# EAGLE design stirrer (EAGLE 7.2.0)
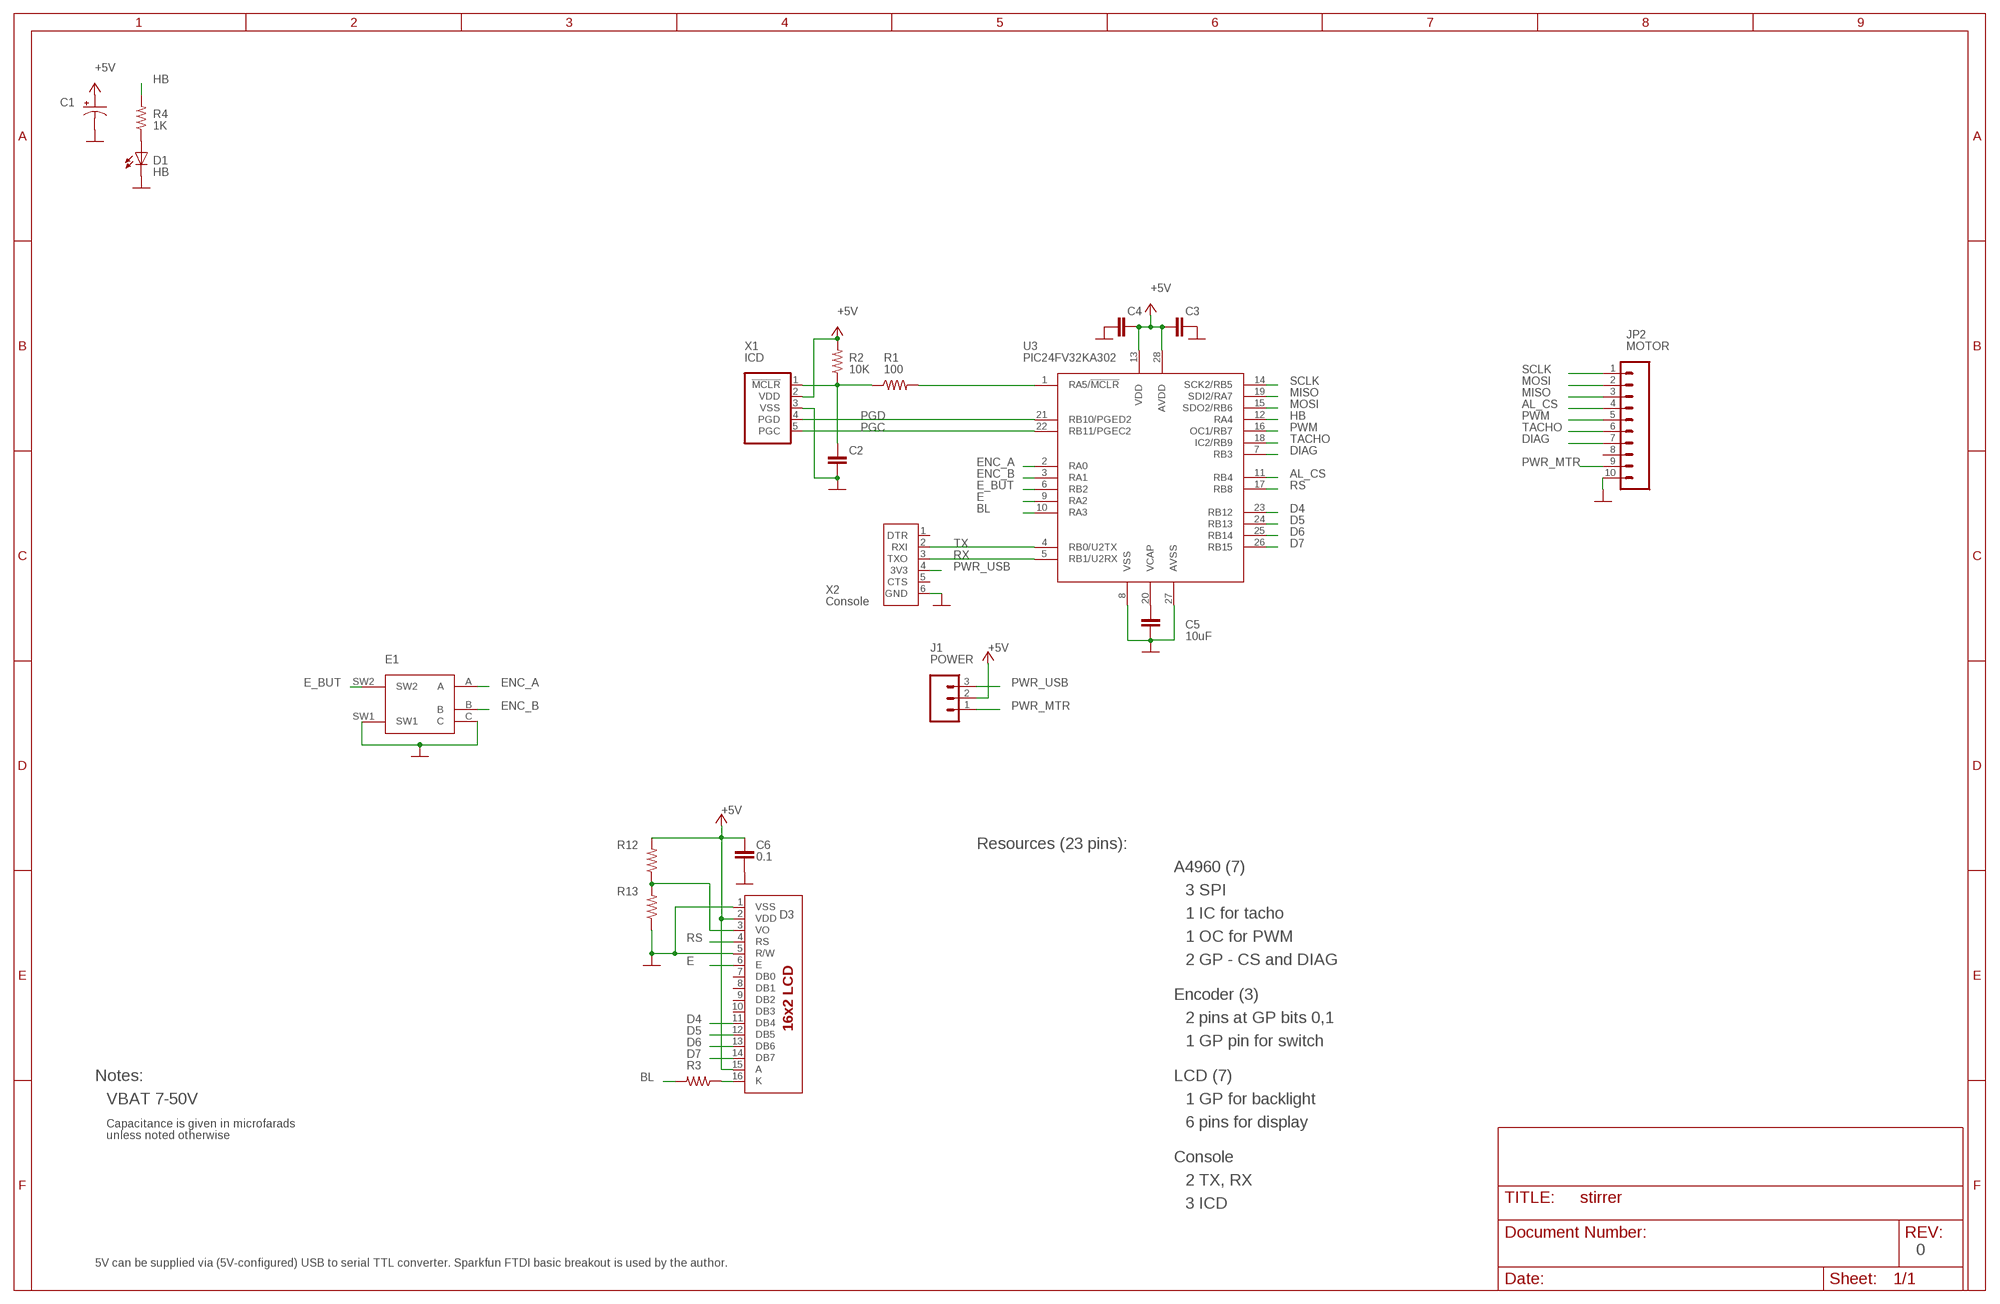
[diagram p0: schematic, sheet 1]

## Parts
C1  CAP_POL-RAD4  [CAP_RAD_4MM]
C2  0.1uF  CAPPTH  [CAP-PTH-SMALL]
C3  0.1uF  CAPPTH  [CAP-PTH-SMALL]
C4  0.1uF  CAPPTH  [CAP-PTH-SMALL]
C5  10uF  CAPPTH  [CAP-PTH-SMALL]
C6  0.1  CAPPTH  [CAP-PTH-SMALL]
D1  HB  LED5MM  [LED5MM]
D3  LCD-16X2-STD  [LCD-16X2]
E1  ROTARY_ENCODER_SWITCH-PEC12_HOR  [ENC_12X14MM_SW_HOR]
J1  POWER  M03PTH  [1X03]
JP2  MOTOR  M100.1  [1X10]
R1  100  RESISTOR-PTH04  [AXIAL-0.4]
R2  10K  RESISTOR-PTH04  [AXIAL-0.4]
R3  RESISTOR-PTH04  [AXIAL-0.4]
R4  1K  RESISTOR-PTH04  [AXIAL-0.4]
R12  RESISTOR-PTH04  [AXIAL-0.4]
R13  RESISTOR-PTH04  [AXIAL-0.4]
U3  PIC24FV32KA302  PIC24FV32KA302_STIR-DIP  [DIL28-3]
X1  ICD  PIC_ICD-STRAIGHT  [1X05]
X2  Console  SERIAL-SF  [1X06]

## Nets
+5V: C1.P(+) C3.1 C4.2 C6.2 D3.2(VDD) D3.15(A) J1.2 R2.P$2 R12.P$2 U3.13(VDD) U3.28(AVDD) X1.2(VDD)
AL_CS: JP2.4 U3.11(RB4)
BL: R3.P$2 U3.10(RA3)
D4: D3.11(DB4) U3.23(RB12)
D5: D3.12(DB5) U3.24(RB13)
D6: D3.13(DB6) U3.25(RB14)
D7: D3.14(DB7) U3.26(RB15)
DIAG: JP2.7 U3.7(RB3)
E: D3.6(E) U3.9(RA2)
E_BUT: E1.SW2 U3.6(RB2)
ENC_A: E1.A U3.2(RA0)
ENC_B: E1.B U3.3(RA1)
GND: C1.N(-) C2.1 C3.2 C4.1 C5.2 C6.1 D1.K(C) D3.1(VSS) D3.5(R/W) E1.C E1.SW1 JP2.10 R13.P$1 U3.8(VSS) U3.27(AVSS) X1.3(VSS) X2.6(GND)
HB: R4.P$2 U3.12(RA4)
MISO: JP2.3 U3.19(SDI2/RA7)
MOSI: JP2.2 U3.15(SDO2/RB6)
N$1: C5.1 U3.20(VCAP)
N$2: R1.P$2 U3.1(RA5/!MCLR)
N$3: D3.16(K) R3.P$1
N$4: D1.A R4.P$1
N$5: D3.3(VO) R12.P$1 R13.P$2
N$12: C2.2 R1.P$1 R2.P$1 X1.1(!MCLR)
PGC: U3.22(RB11/PGEC2) X1.5(PGC)
PGD: U3.21(RB10/PGED2) X1.4(PGD)
PWM: JP2.5 U3.16(OC1/RB7)
PWR_MTR: J1.1 JP2.9
PWR_USB: J1.3 X2.4(3V3)
RS: D3.4(RS) U3.17(RB8)
RX: U3.5(RB1/U2RX) X2.3(TXO)
SCLK: JP2.1 U3.14(SCK2/RB5)
TACHO: JP2.6 U3.18(IC2/RB9)
TX: U3.4(RB0/U2TX) X2.2(RXI)
Unconnected: D3.7(DB0) D3.8(DB1) D3.9(DB2) D3.10(DB3) JP2.8 X2.1(DTR) X2.5(CTS)

## Notes on the sheet
- Resources (23 pins):
- A4960 (7)
- 3 SPI
- 1 IC for tacho
- 1 OC for PWM
- 2 GP - CS and DIAG
- Encoder (3)
- 2 pins at GP bits 0,1
- 1 GP pin for switch
- Notes: | LCD (7)
- VBAT 7-50V | 1 GP for backlight
- Capacitance is given in microfarads | 6 pins for display
- unless noted otherwise
- Console
- 2 TX, RX
- 3 ICD
- 0
- 5V can be supplied via (5V-configured) USB to serial TTL converter. Sparkfun FTDI basic breakout is used by the author.

## Library data of the parts
C1 = ch_passive:CAP_POL: Capacitor Polarized These are standard SMD and PTH capacitors. Normally 10uF, 47uF, and 100uF in electrolytic and tantalum varieties. Always verify the external diameter of the through hole cap, it varies with capacity, voltage, and manufacturer. The EIA devices should be standard.
C2-C6 = ch_passive:CAP: Capacitor Standard 0603 ceramic capacitor, and 0.1" leaded capacitor.
D1 = ch_generic:LED: LEDs Standard schematic elements and footprints for 5mm, 3mm, 1206, and 0603 sized LEDs. 5mm - Spark Fun Electronics SKU : COM-00529 (and others)
D3 = ch_displays:LCD-16X2
E1 = ch_electromech:ROTARY_ENCODER_SWITCH: Rotary Encoder PEC12_HOR - Bourns horizontal PEC12
J1 = ch_connectors:M03: Header 3 Standard 3-pin 0.1" header. Use with straight break away headers (SKU : PRT-00116), right angle break away headers (PRT-00553), swiss pins (PRT-00743), machine pins (PRT-00117), and female headers (PRT-00115). Molex polarized connector foot print use with SKU : PRT-08232 with associated crimp pins and housings.
JP2 = ch_connectors:M10: Header 10 Standard 10-pin 0.1" header. Use with straight break away headers (SKU : PRT-00116), right angle break away headers (PRT-00553), swiss pins (PRT-00743), machine pins (PRT-00117), and female headers (PRT-00115).
R1-R4 R12 R13 = ch_passive:RESISTOR: Resistor Basic schematic elements and footprints for 0603, 1206, and PTH 1/10th watt (small) resistors.
U3 = ch_microchip:PIC24FV32KA302_STIR
X1 = ch_connectors:PIC_ICD
X2 = ch_connectors:SERIAL

## Board
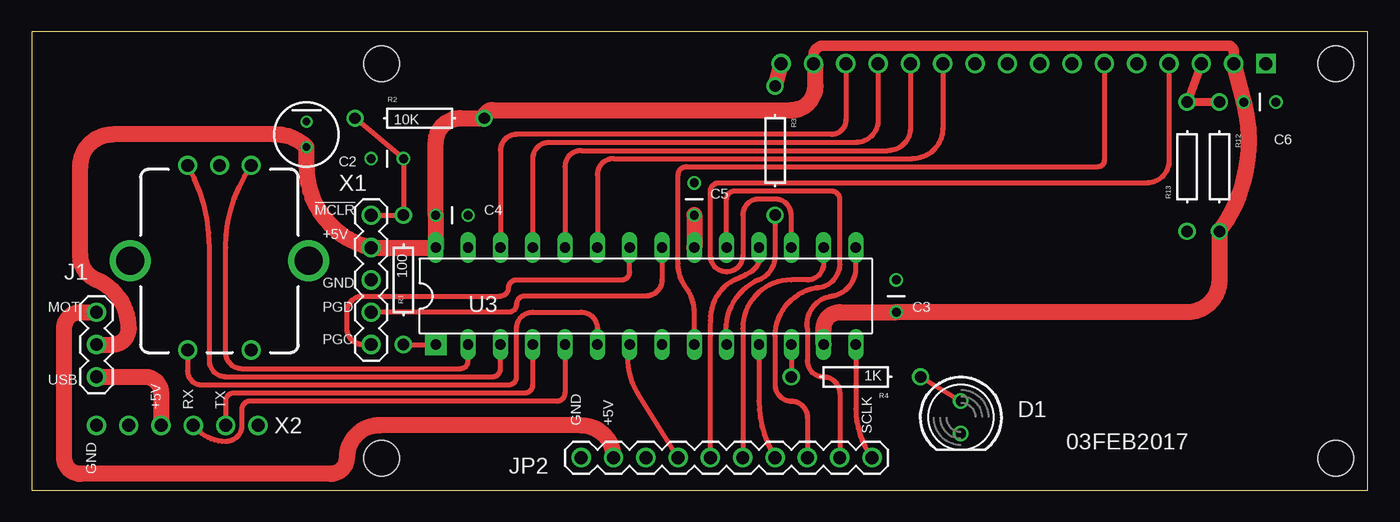
[diagram p1: board, top side]
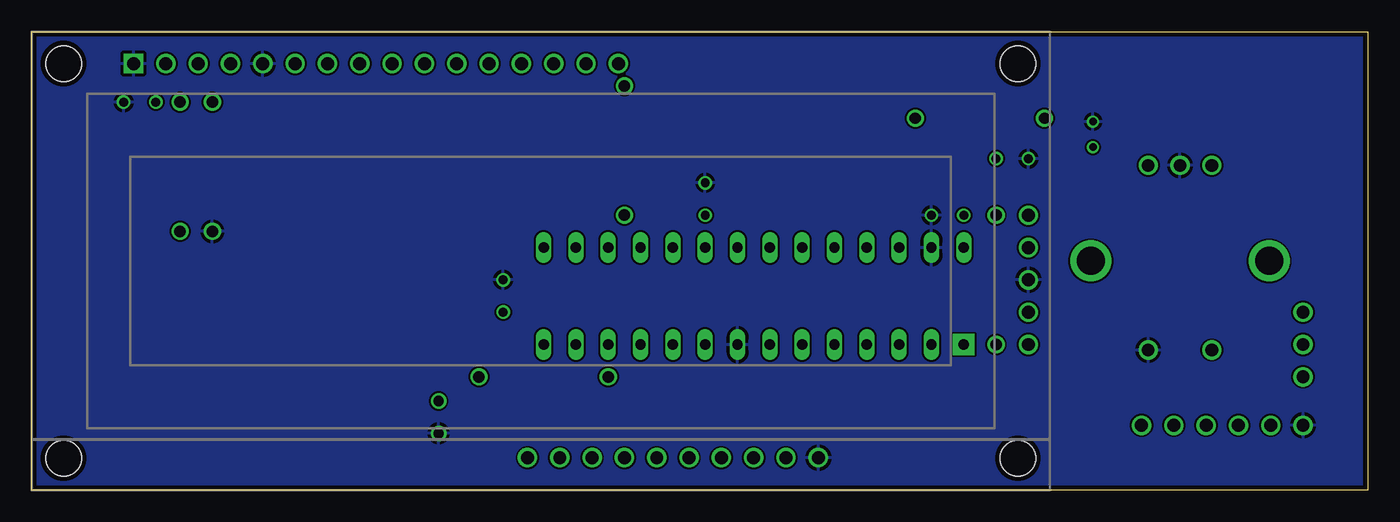
[diagram p2: board, bottom side, seen from below]

Size 105 x 36 mm. Coordinates in mm from the lower left corner, seen from the top.
Outline: 0,0 105,0 105,36 0,36 0,0
Copper layers (1*16): Top 0.0356mm / dielectric 1.5011mm / Bottom 0.0356mm
Design rules "oshpark-2layer": minimum track width 6mil, minimum drill 13mil, track to track 6mil, track to pad 6mil, pad to pad 6mil, via to via 6mil, smd to smd 6mil, copper to edge 15mil, drill to drill 6mil, minimum pad ring 7mil, minimum via ring 7mil, stop-mask expansion 2.5mil, vias tented up to drill 0mil, thermal gap 10mil

### Footprints (pad centres in the part's own frame; a part is rotated, then mirrored left to right if it is on the bottom)
CAP_RAD_4MM = drill 0.6: N -1,0; P 1,0
CAP-PTH-SMALL = drill 0.7: 1 0,0; 2 2.54,0
LED5MM = drill 0.813: A -1.27,0; K 1.27,0
LCD-16X2 = drill 1.016 square: 1 -32,15.5 | drill 1.016: 2 -29.46,15.5; 3 -26.92,15.5; 4 -24.38,15.5; 5 -21.84,15.5; 6 -19.3,15.5; 7 -16.76,15.5; 8 -14.22,15.5; 9 -11.68,15.5; 10 -9.14,15.5; 11 -6.6,15.5; 12 -4.06,15.5; 13 -1.52,15.5; 14 1.02,15.5; 15 3.56,15.5; 16 6.1,15.5 | hole 2.8: -37.5,15.5; -37.5,-15.5; 37.5,15.5; 37.5,-15.5
ENC_12X14MM_SW_HOR = drill 1: A -2.5,-7.5; B 2.5,-7.5; C 0,-7.5; SW1 -2.5,7; SW2 2.5,7 | drill 2.2: P$1 -7,0; P$2 7,0
1X03 = drill 1.016: 1 0,0; 2 2.54,0; 3 5.08,0
1X10 = drill 1.016: 1 0,0; 2 2.54,0; 3 5.08,0; 4 7.62,0; 5 10.16,0; 6 12.7,0; 7 15.24,0; 8 17.78,0; 9 20.32,0; 10 22.86,0
AXIAL-0.4 = drill 0.9: P$1 -5.08,0; P$2 5.08,0
DIL28-3 = drill 0.813 pad 1.676 square: 1 -16.51,-3.81 | drill 0.813 long: 2 -13.97,-3.81; 3 -11.43,-3.81; 4 -8.89,-3.81; 5 -6.35,-3.81; 6 -3.81,-3.81; 7 -1.27,-3.81; 8 1.27,-3.81; 9 3.81,-3.81; 10 6.35,-3.81; 11 8.89,-3.81; 12 11.43,-3.81; 13 13.97,-3.81; 14 16.51,-3.81; 15 16.51,3.81; 16 13.97,3.81; 17 11.43,3.81; 18 8.89,3.81; 19 6.35,3.81; 20 3.81,3.81; 21 1.27,3.81; 22 -1.27,3.81; 23 -3.81,3.81; 24 -6.35,3.81; 25 -8.89,3.81; 26 -11.43,3.81; 27 -13.97,3.81; 28 -16.51,3.81
1X05 = drill 1.016: 1 0,0; 2 2.54,0; 3 5.08,0; 4 7.62,0; 5 10.16,0
1X06 = drill 1.016: 1 0,0; 2 2.54,0; 3 5.08,0; 4 7.62,0; 5 10.16,0; 6 12.7,0

### Placement (x,y rotation side)
C1  21.59,27.94 270 top
C2  26.67,26.04 0 top
C3  67.94,13.97 90 top
C4  34.29,21.59 180 top
C5  52.07,21.59 90 top
C6  97.79,30.48 180 top
D1  73.03,5.71 270 top
D3  65,18 0 bottom
E1  14.75,18 180 top
J1  5.08,13.97 270 top
JP2  66.04,2.54 180 top
R1  29.21,16.51 270 top
R2  30.48,29.21 0 top
R3  58.42,26.67 270 top
R4  64.77,8.89 180 top
R12  93.34,25.4 270 top
R13  90.81,25.4 90 top
U3  48.26,15.24 0 top
X1  26.67,21.59 270 top
X2  17.78,5.08 180 top

### Tracks (layer width: path | path; a pad name or v marks a point on that pad's centre or on a via)
+5V
  Top 0.813: D3.2 94.46,34.45 arc90 93.98,34.92 62.23,34.92 arc90 61.44,34.13 D3.15
  Top 1.27: J1.2 6.35,11.43 arc90 7.62,12.7 arc67 5.08,16.51 arc-67 3.81,18.41 3.81,25.4 arc-90 6.35,27.94 19.05,27.94 arc-48 C1.P 21.59,25.4 arc77 X1.2 U3.28 C4.2 31.75,27.3 arc-90 33.66,29.21 R2.P$2 arc-90 36.2,29.84 59.69,29.84 arc90 61.59,31.75 61.59,33.34 arc90 D3.15 | U3.13 62.23,12.7 arc-90 63.5,13.97 C3.1 90.81,13.97 arc90 93.34,16.51 R12.P$2 arc51 C6.2 D3.2
AL_CS
  Top 0.406: U3.11 57.15,6.99 arc32 JP2.4
BL
  Top 0.406: R3.P$2 58.42,18.41 arc-67 57.15,16.51 arc57 54.61,13.34 arc20 U3.10
D4
  Top 0.406: U3.23 44.45,24.77 arc-90 45.72,26.04 69.22,26.04 arc90 71.6,28.42 D3.11
D5
  Top 0.406: U3.24 41.91,25.4 arc-90 43.18,26.67 67.31,26.67 arc90 69.06,28.42 D3.12
D6
  Top 0.406: U3.25 39.37,26.04 arc-90 40.64,27.3 64.77,27.3 arc90 66.52,29.05 D3.13
D7
  Top 0.406: U3.26 36.83,26.67 arc-90 38.1,27.94 62.87,27.94 arc90 63.98,29.05 D3.14
DIAG
  Top 0.406: JP2.7 47.62,7.62 arc-45 U3.7
E
  Top 0.406: U3.9 52.07,13.97 arc37 51.44,15.88 arc-37 50.8,17.78 50.8,24.77 arc-90 51.44,25.4 83.82,25.4 arc90 84.3,25.88 D3.6
E_BUT
  Top 0.406: U3.6 44.45,12.7 arc90 43.18,13.97 39.37,13.97 arc90 38.1,12.7 38.1,8.89 arc-90 37.47,8.26 13.34,8.26 arc-90 12.25,9.34 E1.SW2
ENC_A
  Top 0.406: U3.2 34.29,10.16 arc-90 33.66,9.53 16.51,9.53 arc-90 15.24,10.79 15.24,19.05 arc-35 E1.A
ENC_B
  Top 0.406: U3.3 36.83,9.53 arc-90 36.2,8.89 15.24,8.89 arc-90 13.97,10.16 13.97,19.05 arc30 E1.B
GND
  pour Bottom: 0,0 105,0 105,36 0,36
HB
  Top 0.406: U3.12 R4.P$2
MISO
  Top 0.406: JP2.3 60.96,5.71 arc90 59.69,6.99 arc-90 58.42,8.26 58.42,12.06 arc-80 61.59,15.88 arc90 63.5,17.78 63.5,22.86 arc90 62.87,23.5 55.24,23.5 arc90 54.61,22.86 U3.19
MOSI
  Top 0.406: U3.15 64.77,17.14 arc-74 62.87,15.24 arc90 60.96,12.7 60.96,10.16 arc90 62.23,8.89 arc-90 63.5,7.62 JP2.2
N$1
  Top 1.27: C5.1 U3.20
N$2
  Top 0.406: R1.P$2 U3.1
N$3
  Top 1.27: D3.16 R3.P$1
N$4
  Top 0.406: R4.P$1 D1.A
N$5
  Top 0.61: D3.3 R13.P$2 R12.P$1
N$12
  Top 0.406: X1.1 R1.P$1 C2.2 R2.P$1
PGC
  Top 0.406: X1.5 26.04,11.43 arc-90 24.77,12.7 24.77,13.97 arc-90 26.04,15.24 36.83,15.24 arc90 37.47,15.88 arc-90 38.1,16.51 46.35,16.51 arc90 46.99,17.14 U3.22
PGD
  Top 0.406: U3.21 49.53,16.51 arc-90 48.26,15.24 38.73,15.24 arc90 38.1,14.61 arc-90 37.47,13.97 X1.4
PWM
  Top 0.406: U3.16 62.23,17.78 arc-90 60.96,16.51 59.69,16.51 arc90 55.88,12.7 JP2.5
PWR_MTR
  Top 1.27: J1.1 3.81,13.97 arc90 2.54,12.7 2.54,2.54 arc90 3.81,1.27 23.5,1.27 arc90 24.77,2.54 arc-90 27.3,5.08 43.18,5.08 arc-90 JP2.9
PWR_USB
  Top 1.27: J1.3 8.89,8.89 arc-90 10.16,7.62 X2.4
RS
  Top 0.406: U3.17 59.69,21.59 arc90 58.42,22.86 57.15,22.86 arc90 55.88,21.59 55.88,18.41 arc-90 54.61,17.14 arc-90 53.34,18.41 53.34,23.5 arc-90 53.98,24.13 87.63,24.13 arc90 89.38,25.88 D3.4
RX
  Top 0.406: U3.5 41.91,7.62 arc-90 41.27,6.99 17.14,6.99 arc90 16.51,6.35 16.51,5.08 arc-90 15.24,3.81 arc-53 X2.3
SCLK
  Top 0.406: U3.14 64.77,6.35 arc37 JP2.1
TACHO
  Top 0.406: JP2.6 53.34,12.06 arc-12 53.34,13.34 arc-66 55.24,16.51 arc1 56.52,17.14 arc73 57.15,18.41 U3.18
TX
  Top 0.406: U3.4 39.37,8.26 arc-90 38.73,7.62 15.88,7.62 arc90 15.24,6.99 X2.2

### Text on the board
tPlace: !MCLR | +5V | GND | MOT | PGD | PGC | USB | +5V | RX | TX | GND | +5V | SCLK | 03FEB2017 | GND